# EAGLE schematic attenuverter1 (EAGLE 7.5.0)
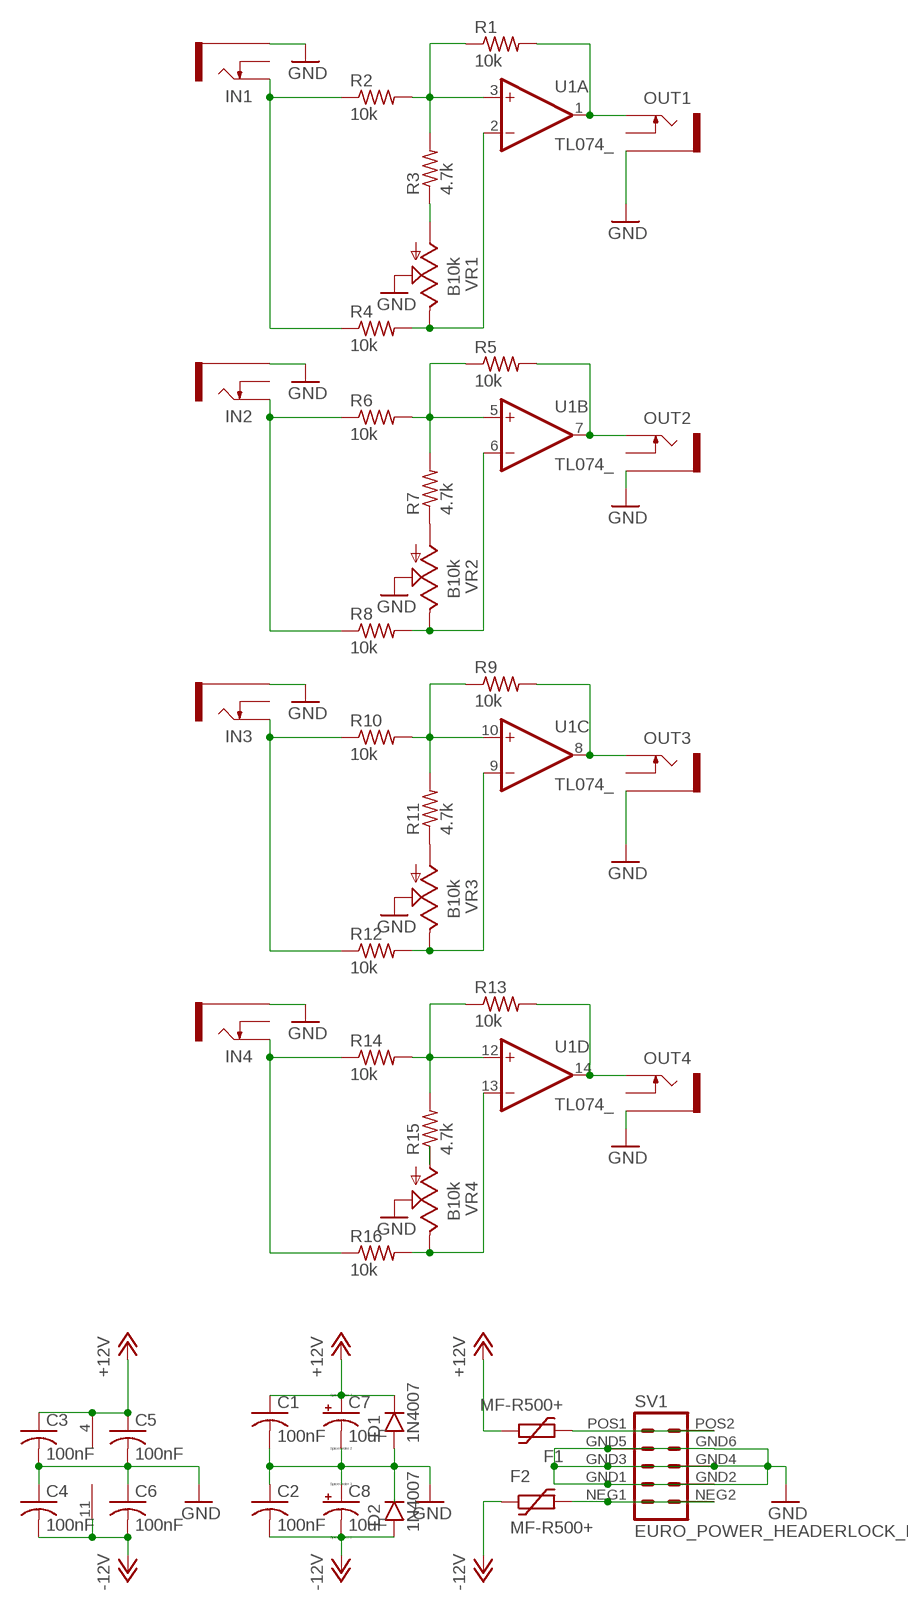
[diagram p0: schematic, sheet 1]

## Parts
C1  100nF  C-US050-055X075  [C050-055X075]
C2  100nF  C-US050-055X075  [C050-055X075]
C3  100nF  C-US050-055X075  [C050-055X075]
C4  100nF  C-US050-055X075  [C050-055X075]
C5  100nF  C-US050-055X075  [C050-055X075]
C6  100nF  C-US050-055X075  [C050-055X075]
C7  10uF  CPOL-USE2.5-6  [E2,5-6]
C8  10uF  CPOL-USE2.5-6  [E2,5-6]
D1  1N4007  1N400X.4  [DO41-4]
D2  1N4007  1N400X.4  [DO41-4]
F1  MF-R500+  [BOURNS-MF-R]
F2  MF-R500+  [BOURNS-MF-R]
IN1  THONKICONNNEW  [WQP-PJ301M-12_JACK]
IN2  THONKICONNNEW  [WQP-PJ301M-12_JACK]
IN3  THONKICONNNEW  [WQP-PJ301M-12_JACK]
IN4  THONKICONNNEW  [WQP-PJ301M-12_JACK]
OUT1  THONKICONNNEW  [WQP-PJ301M-12_JACK]
OUT2  THONKICONNNEW  [WQP-PJ301M-12_JACK]
OUT3  THONKICONNNEW  [WQP-PJ301M-12_JACK]
OUT4  THONKICONNNEW  [WQP-PJ301M-12_JACK]
R1  10k  R-US_0207/7  [0207/7]
R2  10k  R-US_0207/7  [0207/7]
R3  4.7k  R-US_0207/7  [0207/7]
R4  10k  R-US_0207/7  [0207/7]
R5  10k  R-US_0207/7  [0207/7]
R6  10k  R-US_0207/7  [0207/7]
R7  4.7k  R-US_0207/7  [0207/7]
R8  10k  R-US_0207/7  [0207/7]
R9  10k  R-US_0207/7  [0207/7]
R10  10k  R-US_0207/7  [0207/7]
R11  4.7k  R-US_0207/7  [0207/7]
R12  10k  R-US_0207/7  [0207/7]
R13  10k  R-US_0207/7  [0207/7]
R14  10k  R-US_0207/7  [0207/7]
R15  4.7k  R-US_0207/7  [0207/7]
R16  10k  R-US_0207/7  [0207/7]
SV1  EURO_POWER_HEADERLOCK_PADS  [EURO_PWR_HEADER_LOCK]
U1  TL074_  [DIL14]
VR1  B10k  9MM_SNAP-IN_POT_  [9MM_SNAP-IN_POT]
VR2  B10k  9MM_SNAP-IN_POT_  [9MM_SNAP-IN_POT]
VR3  B10k  9MM_SNAP-IN_POT_  [9MM_SNAP-IN_POT]
VR4  B10k  9MM_SNAP-IN_POT_  [9MM_SNAP-IN_POT]

## Nets
+12V: C1.1 C3.1 C5.1 C7.+ D1.C F1.P$2 U1.4(P:V+)
-12V: C2.2 C4.2 C6.2 C8.- D2.A F2.P$1 U1.11(P:V-)
GND: C1.2 C2.1 C3.2 C4.1 C5.2 C6.1 C7.- C8.+ D1.A IN1.P$3_SLEEVE(SLEEVE) IN2.P$3_SLEEVE(SLEEVE) IN3.P$3_SLEEVE(SLEEVE) IN4.P$3_SLEEVE(SLEEVE) OUT1.P$3_SLEEVE(SLEEVE) OUT2.P$3_SLEEVE(SLEEVE) OUT3.P$3_SLEEVE(SLEEVE) OUT4.P$3_SLEEVE(SLEEVE) SV1.GND1 SV1.GND2 SV1.GND3 SV1.GND4 SV1.GND5 SV1.GND6 VR1.2(S) VR2.2(S) VR3.2(S) VR4.2(S)
N$1: R1.1 R2.2 R3.2 U1.3(A:+IN)
N$2: IN1.P$1_TIP(TIP) R2.1 R4.1
N$3: R4.2 U1.2(A:-IN) VR1.3(E)
N$4: R3.1 VR1.1(A)
N$5: IN2.P$1_TIP(TIP) R6.1 R8.1
N$6: R5.1 R6.2 R7.2 U1.5(B:+IN)
N$7: OUT1.P$1_TIP(TIP) R1.2 U1.1(A:OUT)
N$8: R8.2 U1.6(B:-IN) VR2.3(E)
N$9: F2.P$2 SV1.NEG1 SV1.NEG2
N$10: F1.P$1 SV1.POS1 SV1.POS2
N$11: R7.1 VR2.1(A)
N$12: OUT2.P$1_TIP(TIP) R5.2 U1.7(B:OUT)
N$13: IN3.P$1_TIP(TIP) R10.1 R12.1
N$14: R9.1 R10.2 R11.2 U1.10(C:+IN)
N$15: R12.2 U1.9(C:-IN) VR3.3(E)
N$16: R11.1 VR3.1(A)
N$17: OUT3.P$1_TIP(TIP) R9.2 U1.8(C:OUT)
N$18: IN4.P$1_TIP(TIP) R14.1 R16.1
N$19: R13.1 R14.2 R15.2 U1.12(D:+IN)
N$20: R16.2 U1.13(D:-IN) VR4.3(E)
N$21: R15.1 VR4.1(A)
N$22: OUT4.P$1_TIP(TIP) R13.2 U1.14(D:OUT)
Unconnected: D2.C IN1.P$2_SWITCH(SWITCH) IN2.P$2_SWITCH(SWITCH) IN3.P$2_SWITCH(SWITCH) IN4.P$2_SWITCH(SWITCH) OUT1.P$2_SWITCH(SWITCH) OUT2.P$2_SWITCH(SWITCH) OUT3.P$2_SWITCH(SWITCH) OUT4.P$2_SWITCH(SWITCH)

## Library data of the parts
C1-C6 = resistor:C-US: CAPACITOR, American symbol
C7 C8 = resistor:CPOL-US: POLARIZED CAPACITOR, American symbol
D1 D2 = gm-diodes:1N400X: Rectifier Diodes often used in power supply to prevent damage from reverse polarization
F1 F2 = ptc-littlefuse:MF-R500+: http://www.farnell.com/datasheets/1817521.pdf
IN1-IN4 OUT1-OUT4 = MusicThingModular:THONKICONN: 3.5mm socket for Eurorack modular synths
R1-R16 = resistor:R-US_: RESISTOR, American symbol
SV1 = MusicThingModular:EURO_POWER_HEADER: Power Header 10 pin power header for Eurorack Power Supplies Variants with fatter pads for easier soldering, and the LOCK variant which has 5mil offset pins to hold the component in place before soldering
U1 = MusicThingModular:TL074: Generic Quad Op Amp
VR1-VR4 = MusicThingModular:9MM_SNAP-IN_POT: 9mm vertical snap-in pot, Alpha / Panasonic style